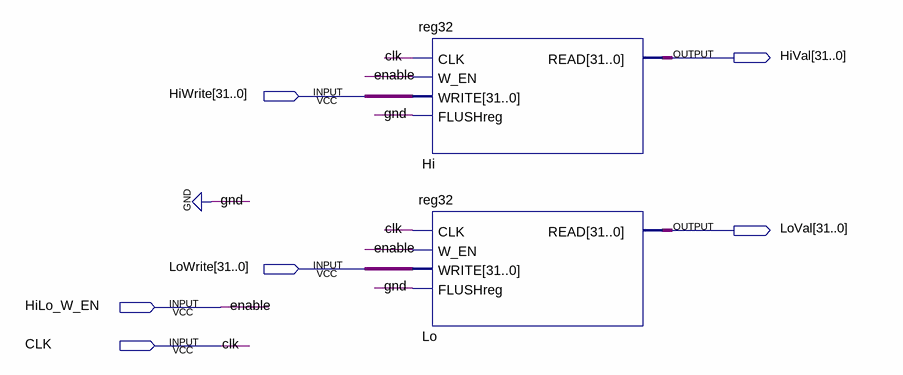
[diagram p0: schematic sheet]
// Quartus schematic HiLoReg.bdf as structural Verilog: 2 symbols, 6 pins
module HiLoReg (
  input  [31:0] HiWrite,
  input  [31:0] LoWrite,
  input  HiLo_W_EN,
  input  CLK,
  output [31:0] HiVal,
  output [31:0] LoVal
);

  reg32 Hi (.CLK(CLK), .W_EN(HiLo_W_EN), .WRITE(HiWrite), .FLUSHreg(1'b0), .READ(HiVal));
  reg32 Lo (.CLK(CLK), .W_EN(HiLo_W_EN), .WRITE(LoWrite), .FLUSHreg(1'b0), .READ(LoVal));

  // Other names for the same wires on the sheet: enable = HiLo_W_EN
endmodule
